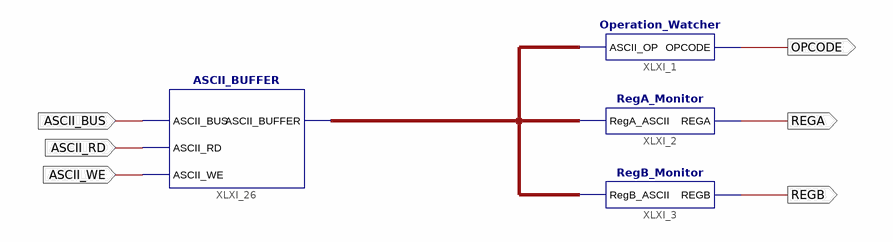
[diagram p0: schematic sheet 1]
// Xilinx ISE schematic Debug_Unit.sch (spartan3e) as structural Verilog: 4 symbols, 6 ports
module Debug_Unit (
  input  ASCII_BUS,
  input  ASCII_RD,
  input  ASCII_WE,
  output OPCODE,
  output REGA,
  output REGB
);

  wire [15:0] XLXN_4;

  Operation_Watcher XLXI_1 (.ASCII_OP(XLXN_4), .OPCODE(OPCODE));
  RegA_Monitor XLXI_2 (.RegA_ASCII(XLXN_4), .REGA(REGA));
  RegB_Monitor XLXI_3 (.RegB_ASCII(XLXN_4), .REGB(REGB));
  ASCII_BUFFER XLXI_26 (.ASCII_BUS(ASCII_BUS), .ASCII_RD(ASCII_RD), .ASCII_WE(ASCII_WE), .ASCII_BUFFER(XLXN_4));
endmodule
